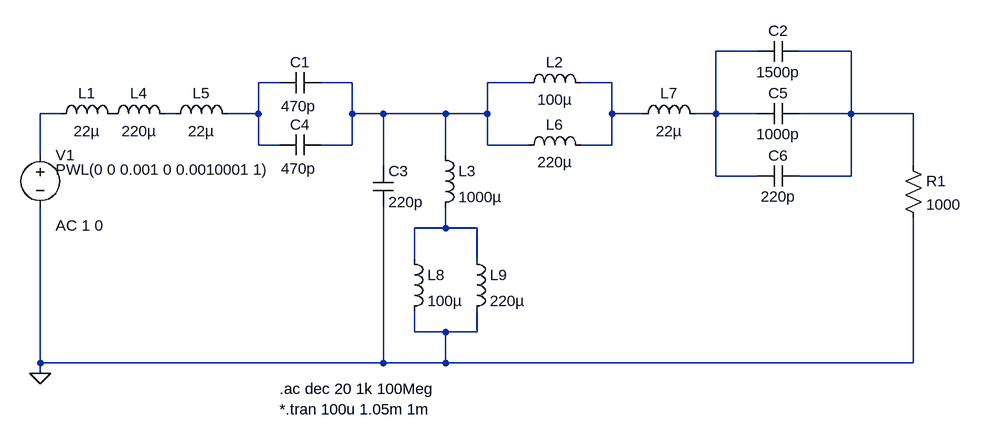
[diagram p0: schematic 5_butter_bpf.asc]
5_butter_bpf.asc, the LTspice schematic file:
Version 4
SHEET 1 1068 680
WIRE 720 -16 656 -16
WIRE 864 -16 784 -16
WIRE -16 32 -48 32
WIRE 96 32 48 32
WIRE 368 32 304 32
WIRE 496 32 448 32
WIRE -352 80 -384 80
WIRE -176 80 -192 80
WIRE -48 80 -48 32
WIRE -48 80 -96 80
WIRE 96 80 96 32
WIRE 144 80 96 80
WIRE 240 80 144 80
WIRE 304 80 304 32
WIRE 304 80 240 80
WIRE 496 80 496 32
WIRE 544 80 496 80
WIRE 656 80 656 -16
WIRE 656 80 624 80
WIRE 720 80 656 80
WIRE 864 80 864 -16
WIRE 864 80 784 80
WIRE 960 80 864 80
WIRE -48 128 -48 80
WIRE -16 128 -48 128
WIRE 96 128 96 80
WIRE 96 128 48 128
WIRE 304 128 304 80
WIRE 368 128 304 128
WIRE 496 128 496 80
WIRE 496 128 448 128
WIRE -384 144 -384 80
WIRE 240 144 240 80
WIRE 144 160 144 80
WIRE 960 160 960 80
WIRE 656 176 656 80
WIRE 720 176 656 176
WIRE 864 176 864 80
WIRE 864 176 784 176
WIRE 240 256 240 224
WIRE 240 256 192 256
WIRE 288 256 240 256
WIRE 192 304 192 256
WIRE 288 304 288 256
WIRE 192 416 192 384
WIRE 240 416 192 416
WIRE 288 416 288 384
WIRE 288 416 240 416
WIRE -384 464 -384 224
WIRE 144 464 144 224
WIRE 144 464 -384 464
WIRE 240 464 240 416
WIRE 240 464 144 464
WIRE 960 464 960 240
WIRE 960 464 240 464
WIRE -384 480 -384 464
FLAG -384 480 0
SYMBOL voltage -384 128 R0
WINDOW 123 24 124 Left 2
WINDOW 39 0 0 Left 2
WINDOW 3 24 38 Left 2
SYMATTR Value2 AC 1 0
SYMATTR InstName V1
SYMATTR Value PWL(0 0 0.001 0 0.0010001 1)
SYMBOL res 944 144 R0
SYMATTR InstName R1
SYMATTR Value 1000
SYMBOL cap 48 16 R90
WINDOW 0 0 32 VBottom 2
WINDOW 3 37 34 VTop 2
SYMATTR InstName C1
SYMATTR Value 470p
SYMBOL ind 224 128 R0
SYMATTR InstName L3
SYMATTR Value 1000µ
SYMBOL ind -368 96 R270
WINDOW 0 32 56 VTop 2
WINDOW 3 5 56 VBottom 2
SYMATTR InstName L1
SYMATTR Value 22µ
SYMBOL ind 352 48 R270
WINDOW 0 32 56 VTop 2
WINDOW 3 5 56 VBottom 2
SYMATTR InstName L2
SYMATTR Value 100µ
SYMBOL cap 128 160 R0
SYMATTR InstName C3
SYMATTR Value 220p
SYMBOL ind -288 96 R270
WINDOW 0 32 56 VTop 2
WINDOW 3 5 56 VBottom 2
SYMATTR InstName L4
SYMATTR Value 220µ
SYMBOL ind -192 96 R270
WINDOW 0 32 56 VTop 2
WINDOW 3 5 56 VBottom 2
SYMATTR InstName L5
SYMATTR Value 22µ
SYMBOL cap 48 112 R90
WINDOW 0 0 32 VBottom 2
WINDOW 3 37 34 VTop 2
SYMATTR InstName C4
SYMATTR Value 470p
SYMBOL ind 352 144 R270
WINDOW 0 32 56 VTop 2
WINDOW 3 5 56 VBottom 2
SYMATTR InstName L6
SYMATTR Value 220µ
SYMBOL ind 528 96 R270
WINDOW 0 32 56 VTop 2
WINDOW 3 5 56 VBottom 2
SYMATTR InstName L7
SYMATTR Value 22µ
SYMBOL cap 784 64 R90
WINDOW 0 0 32 VBottom 2
WINDOW 3 32 32 VTop 2
SYMATTR InstName C5
SYMATTR Value 1000p
SYMBOL cap 784 160 R90
WINDOW 0 0 32 VBottom 2
WINDOW 3 32 32 VTop 2
SYMATTR InstName C6
SYMATTR Value 220p
SYMBOL cap 784 -32 R90
WINDOW 0 0 32 VBottom 2
WINDOW 3 32 32 VTop 2
SYMATTR InstName C2
SYMATTR Value 1500p
SYMBOL ind 176 288 R0
SYMATTR InstName L8
SYMATTR Value 100µ
SYMBOL ind 272 288 R0
SYMATTR InstName L9
SYMATTR Value 220µ
TEXT -16 504 Left 2 !.ac dec 20 1k 100Meg\n*.tran 100u 1.05m 1m

The netlist it stands for:
* 5_butter_bpf.asc
V1 N006 0 PWL(0 0 0.001 0 0.0010001 1) AC 1 0
R1 N002 0 1000
C1 N004 N003 470p
L3 N004 N008 1000µ
L1 N006 P001 22µ
L2 N004 N005 100µ
C3 N004 0 220p
L4 P001 N007 220µ
L5 N007 N003 22µ
C4 N004 N003 470p
L6 N004 N005 220µ
L7 N005 N001 22µ
C5 N002 N001 1000p
C6 N002 N001 220p
C2 N002 N001 1500p
L8 N008 0 100µ
L9 N008 0 220µ
.ac dec 20 1k 100Meg
*.tran 100u 1.05m 1m
.backanno
.end